# EAGLE design gamebuino-hack (EAGLE 9.5.2)
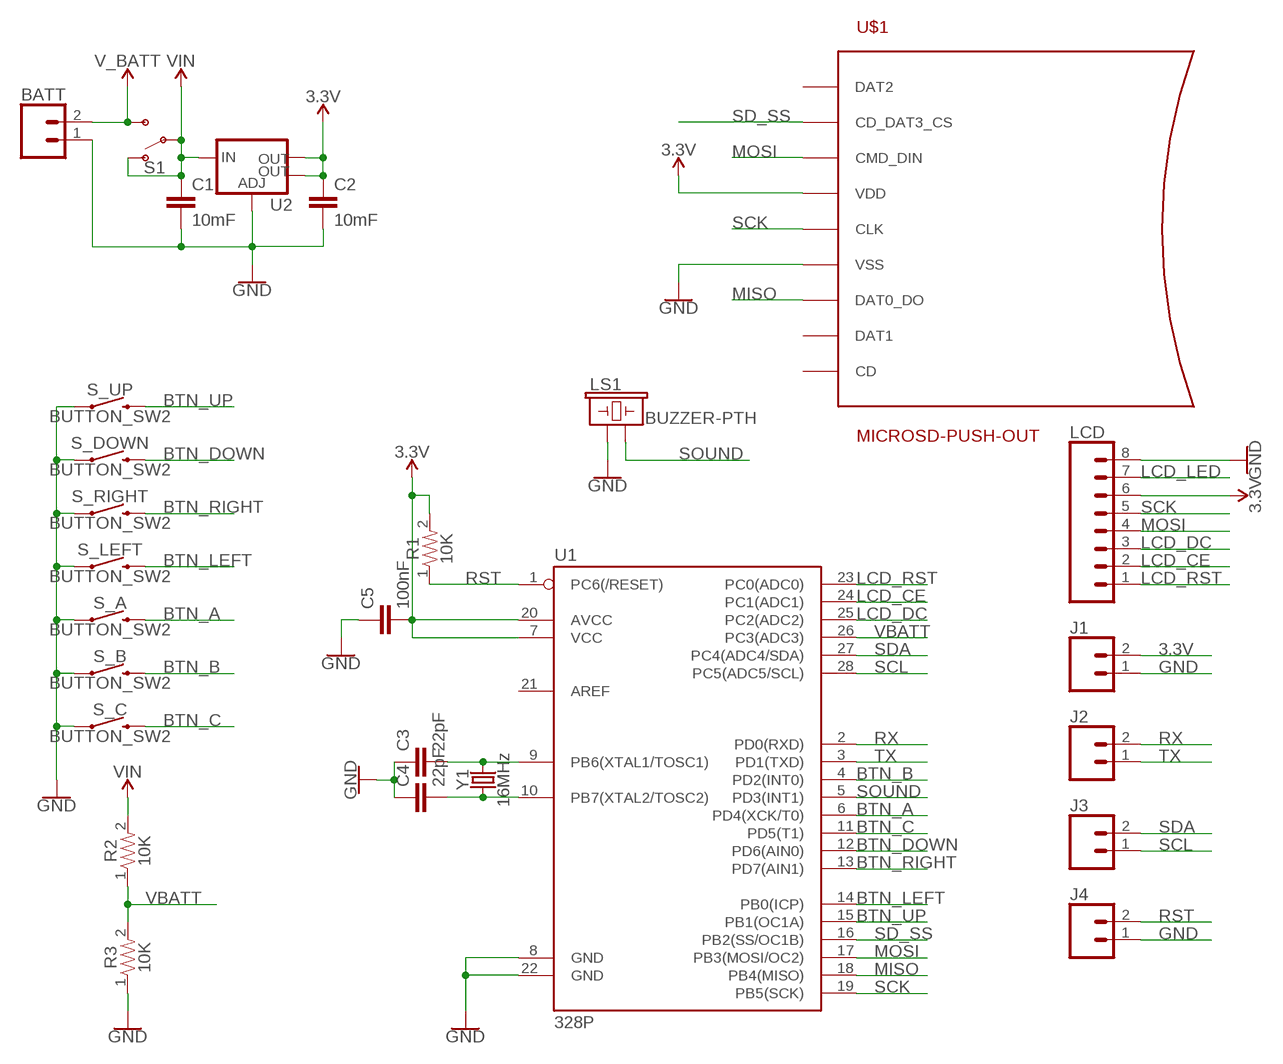
[diagram p0: schematic, sheet 1]

## Parts
BATT  CONN_02  [1X02]
C1  10mF  CAP-805  [0805]
C2  10mF  CAP-805  [0805]
C3  22pF  CAP-805  [0805]
C4  22pF  CAP-805  [0805]
C5  100nF  CAP-805  [0805]
J1  CONN_02  [1X02]
J2  CONN_02  [1X02]
J3  CONN_02  [1X02]
J4  CONN_02  [1X02]
LCD  CONN_08"  [1X08]
LS1  BUZZER-PTH  [BUZZER-12MM]
R1  10K  RESISTOR-805  [0805]
R2  10K  RESISTOR-805  [0805]
R3  10K  RESISTOR-805  [0805]
S1  SWITCH-SPDT-PTH-11.6X4.0MM  [SWITCH_SPDT_PTH_11.6X4.0MM]
S_A  BUTTON_SW2  [BUTTON_SW2]
S_B  BUTTON_SW2  [BUTTON_SW2]
S_C  BUTTON_SW2  [BUTTON_SW2]
S_DOWN  BUTTON_SW2  [BUTTON_SW2]
S_LEFT  BUTTON_SW2  [BUTTON_SW2]
S_RIGHT  BUTTON_SW2  [BUTTON_SW2]
S_UP  BUTTON_SW2  [BUTTON_SW2]
U1  328P  ATMEGA328P_PDIP  [DIP28]
U2  V_REG_LM1117SOT223  [SOT223]
U$1  MICROSD-PUSH-OUT  [MICROSD-PUSH-OUT]
Y1  16MHz  CRYSTAL-16MHZPTH-HC49US  [HC49US]

## Nets
3.3V: C2.1 C5.2 J1.2 LCD.6 R1.2 U1.7(VCC) U1.20(AVCC) U2.2(OUT) U2.4(OUT) U$1.4(VDD)
BTN_A: S_A.2 U1.6(PD4(XCK/T0))
BTN_B: S_B.2 U1.4(PD2(INT0))
BTN_C: S_C.2 U1.11(PD5(T1))
BTN_DOWN: S_DOWN.2 U1.12(PD6(AIN0))
BTN_LEFT: S_LEFT.2 U1.14(PB0(ICP))
BTN_RIGHT: S_RIGHT.2 U1.13(PD7(AIN1))
BTN_UP: S_UP.2 U1.15(PB1(OC1A))
GND: BATT.1 C1.2 C2.2 C3.1 C4.1 C5.1 J1.1 J4.1 LCD.8 LS1.+ R3.1 S_A.1 S_B.1 S_C.1 S_DOWN.1 S_LEFT.1 S_RIGHT.1 S_UP.1 U1.8(GND) U1.22(GND) U2.1(ADJ) U$1.6(VSS) U$1.G1(VSS) U$1.G2(VSS) U$1.G3(VSS) U$1.G4(VSS)
LCD_CE: LCD.2 U1.24(PC1(ADC1))
LCD_DC: LCD.3 U1.25(PC2(ADC2))
LCD_LED: LCD.7
LCD_RST: LCD.1 U1.23(PC0(ADC0))
MISO: U1.18(PB4(MISO)) U$1.7(DAT0_DO)
MOSI: LCD.4 U1.17(PB3(MOSI/OC2)) U$1.3(CMD_DIN)
N$9: C3.2 U1.9(PB6(XTAL1/TOSC1)) Y1.2
N$10: C4.2 U1.10(PB7(XTAL2/TOSC2)) Y1.1
RST: J4.2 R1.1 U1.1(PC6(/RESET))
RX: J2.2 U1.2(PD0(RXD))
SCK: LCD.5 U1.19(PB5(SCK)) U$1.5(CLK)
SCL: J3.1 U1.28(PC5(ADC5/SCL))
SD_SS: U1.16(PB2(SS/OC1B)) U$1.2(CD_DAT3_CS)
SDA: J3.2 U1.27(PC4(ADC4/SDA))
SOUND: LS1.- U1.5(PD3(INT1))
TX: J2.1 U1.3(PD1(TXD))
V_BATT: BATT.2 S1.3(S)
VBATT: R2.1 R3.2 U1.26(PC3(ADC3))
VIN: C1.1 R2.2 S1.1(O) S1.2(P) U2.3(IN)
Unconnected: U1.21(AREF) U$1.1(DAT2) U$1.8(DAT1) U$1.CD

## Library data of the parts
BATT J1-J4 = SparkFun-Connectors:CONN_02: Multi connection point. Often used as Generic Header-pin footprint for 0.1 inch spaced/style header connections On any of the 0.1 inch spaced packages, you can populate with these: Break Away Headers - Straight <https://www.sparkfun.com/products/116> (PRT-00116) Break Away Male Headers - Right Angle <https://www.sparkfun.com/products/553> (PRT-00553) Female Headers <https://www.sparkfun.com/products/115> (PRT-00115) Break Away Headers - Machine Pin <https://www.sparkfun.com/products/117> (PRT-00117) Break Away Female Headers - Swiss Machine Pin <https://www.sparkfun.com/products/743> (PRT-00743) For SCREWTERMINALS and SPRING TERMINALS visit here: Screw Terimnals on SparkFun.com <https://www.sparkfun.com/search/results?term=Screw+Terminals> (5mm/3.5mm/2.54mm spacing) This device is also useful as a general connection point to wire up your design to another part of your project. Our various solder wires solder well into these plated through hole pads. Hook-Up Wire - Assortment (Stranded, 22 AWG) <https://www.sparkfun.com/products/11375> (PRT-11375) Hook-Up Wire - Assortment (Solid Core, 22 AWG) <https://www.sparkfun.com/products/11367> (PRT-11367) View the entire wire category on our website here <https://www.sparkfun.com/categories/141> Special notes: Molex polarized connector foot print use with: PRT-08233 with associated crimp pins and housings. 2.54_SCREWTERM for use with PRT-10571. 3.5mm Screw Terminal footprints for PRT-08084 5mm Screw Terminal footprints for use with PRT-08432
C1-C5 = myParts:CAP: Generic capacitor
LCD = SparkFun-Connectors:CONN_08: Multi connection point. Often used as Generic Header-pin footprint for 0.1 inch spaced/style header connections On any of the 0.1 inch spaced packages, you can populate with these: Break Away Headers - Straight <https://www.sparkfun.com/products/116> (PRT-00116) Break Away Male Headers - Right Angle <https://www.sparkfun.com/products/553> (PRT-00553) Female Headers <https://www.sparkfun.com/products/115> (PRT-00115) Break Away Headers - Machine Pin <https://www.sparkfun.com/products/117> (PRT-00117) Break Away Female Headers - Swiss Machine Pin <https://www.sparkfun.com/products/743> (PRT-00743) Arduino Stackable Header - 8 Pin <https://www.sparkfun.com/products/9279> (PRT-09279) For SCREWTERMINALS and SPRING TERMINALS visit here: Screw Terimnals on SparkFun.com <https://www.sparkfun.com/search/results?term=Screw+Terminals> (5mm/3.5mm/2.54mm spacing) This device is also useful as a general connection point to wire up your design to another part of your project. Our various solder wires solder well into these plated through hole pads. Hook-Up Wire - Assortment (Stranded, 22 AWG) <https://www.sparkfun.com/products/11375> (PRT-11375) Hook-Up Wire - Assortment (Solid Core, 22 AWG) <https://www.sparkfun.com/products/11367> (PRT-11367) View the entire wire category on our website here <https://www.sparkfun.com/categories/141> Special notes: Molex polarized connector foot print use with SKU : PRT-08231 with associated crimp pins and housings. 1MM SMD Version SKU: PRT-10208 NOTES ON THE VARIANTS LOCK and LOCK_LONGPADS... This footprint was designed to help hold the alignment of a through-hole component (i.e. 6-pin header) while soldering it into place. You may notice that each hole has been shifted either up or down by 0.005 of an inch from it's more standard position (which is a perfectly straight line). This slight alteration caused the pins (the squares in the middle) to touch the edges of the holes. Because they are alternating, it causes a "brace" to hold the component in place. 0.005 has proven to be the perfect amount of "off-center" position when using our standard breakaway headers. Although looks a little odd when you look at the bare footprint, once you have a header in there, the alteration is very hard to notice. Also,if you push a header all the way into place, it is covered up entirely on the bottom side.; PROD_ID: CONN-08438
LS1 = SparkFun-Electromechanical:BUZZER: Buzzer Small round buzzers that operate around the audible 2kHz range. You can use these as speakers to create simple music or user interfaces. Variant Overview: PTH - Mini Speaker - PC Mount 12mm 2.048kHz <https://www.sparkfun.com/products/7950> PTH_KIT - Mini Speaker - PC Mount 12mm 2.048kHz <https://www.sparkfun.com/products/7950> KIT simplifies soldering by adding stop mask to one side of the pads. PTH_NO_SILK - Mini Speaker - PC Mount 12mm 2.048kHz <https://www.sparkfun.com/products/7950> No silkscreen indicator of buzzer outline. PTH_KIT_NO_SILK - Mini Speaker - PC Mount 12mm 2.048kHz <https://www.sparkfun.com/products/7950> KIT package w/o silkscreen SMD - Buzzer Audio Magnetic (CCV-084B16) SMD buzzer used on, e.g. the LilyPad Buzzer <https://www.sparkfun.com/products/8463> and RFID USB Reader <https://www.sparkfun.com/products/9963>. SMD_KIT - Buzzer Audio Magnetic (CCV-084B16) SMD Buzzer with elongated pins to make soldering easier. Used on the SparkFun Simon Says - Surface Mount Soldering Kit <https://www.sparkfun.com/products/10935>.; PROD_ID: COMP-08253; SF_SKU: COM-07950
R1-R3 = myParts:RESISTOR: Generic resistor
S1 = SparkFun-Switches:SWITCH-SPDT: Single Pole, Double Throw (SPDT) Switch Single-pole, double-throw (SPDT) switch. Variant Overview SMD-AYZ0202 Surface Mount DPDT Switch <https://www.sparkfun.com/products/597> (COM-00597) Used on e.g. LilyPad Arduino USB - ATmega32U4 Board <https://www.sparkfun.com/products/12049> PTH-11.6X4.0MM SPDT Mini Power Switch <https://www.sparkfun.com/products/102> (COM-00102) Used on e.g. SparkFun Simon Says - Through-Hole Soldering Kit <https://www.sparkfun.com/products/10547> (KIT-10547) PTH-11.6X4.0MM-KIT KIT version of SPDT Mini Power Switch - Simplifies soldering by removing tStop of switch pins - only one side can be soldered. PTH-11.6X4.0MM-LOCK LOCK version of SPDT Mini Power Switch - Offset pins hold switch in place for easier soldering. SMD-RIGHT-ANGLE Surface Mount Right Angle Switch <https://www.sparkfun.com/products/10860> (COM-10860) Used on e.g. SparkFun ESP8266 Thing <https://www.sparkfun.com/products/13231>; PROD_ID: SWCH-08261; SF_SKU: COM-00102
S_A S_B S_C S_DOWN S_LEFT S_RIGHT S_UP = myParts:BUTTON_SW2: 2 connector push button
U1 = SparkFun-IC-Microcontroller:ATMEGA328P_PDIP: Atmel 328P Through hole ATMEGA328P uC used in the Arduino 32kb flash, 1k EEPROM, 2k SRAM Datasheet <http://www.sparkfun.com/datasheets/Components/SMD/ATMega328.pdf> SparkFun Products Storefront component: AVR 28 Pin 20MHz 32K 6A/D - ATMega328P <https://www.sparkfun.com/products/9061> (COM-09061) SparkFun Simon Says - Through-Hole Soldering Kit <https://www.sparkfun.com/products/10547> (KIT-10547) SparkFun Learn to Solder - Simon Says <https://www.sparkfun.com/products/13708> (KIT-13708) SparkFun BigTime Watch Kit <https://www.sparkfun.com/products/11734> (KIT-11734) SparkFun ClockIt <https://www.sparkfun.com/products/10930> (KIT-10930) SparkFun Serial Enabled LCD Kit <https://www.sparkfun.com/products/10097> (LCD-10097) SparkFun Simon Tilts - Through Hole Soldering Kit <https://www.sparkfun.com/products/12634> (KIT-12634) SparkFun Frequency Counter Kit <https://www.sparkfun.com/products/10140> (KIT-10140) FabFM Radio Kit <https://www.sparkfun.com/products/11043> (KIT-11043) SparkFun Binary Blaster Kit <https://www.sparkfun.com/products/12037> (KIT-12037) SparkFun Metro-Gnome <https://www.sparkfun.com/products/9236> (KIT-09236) ATmega328 with Arduino Optiboot (Uno) <https://www.sparkfun.com/products/10524> (DEV-10524); PROD_ID: IC-09136
U2 = SparkFun-IC-Power:V_REG_LM1117: Voltage Regulator LM1117 Standard adjustable voltage regulator but in SMD form. Spark Fun Electronics SKU : COM-00595; PROD_ID: VREG-08170
U$1 = microsd:MICROSD-PUSH-OUT: T-Flash Push-Out Micro SD Card Reader 14.75mm x 14.5mm SMD with external pins
Y1 = SparkFun-Clocks:CRYSTAL-16MHZ: 16MHz Crystal Digikey Example <http://www.digikey.com/product-search/en?keywords=535-9122-1-ND> Frequency: 16MHz Frequency Stability: ±50ppm Frequency Tolerance: ±20ppm Load Capacitance: 18pF SparkFun Products: Pro Micro -5V/16MHz <https://www.sparkfun.com/products/12640> SparkFun Serial Enabled LCD Kit <https://www.sparkfun.com/products/10097>; PROD_ID: XTAL-08181; SF_ID: COM-00536

## Board
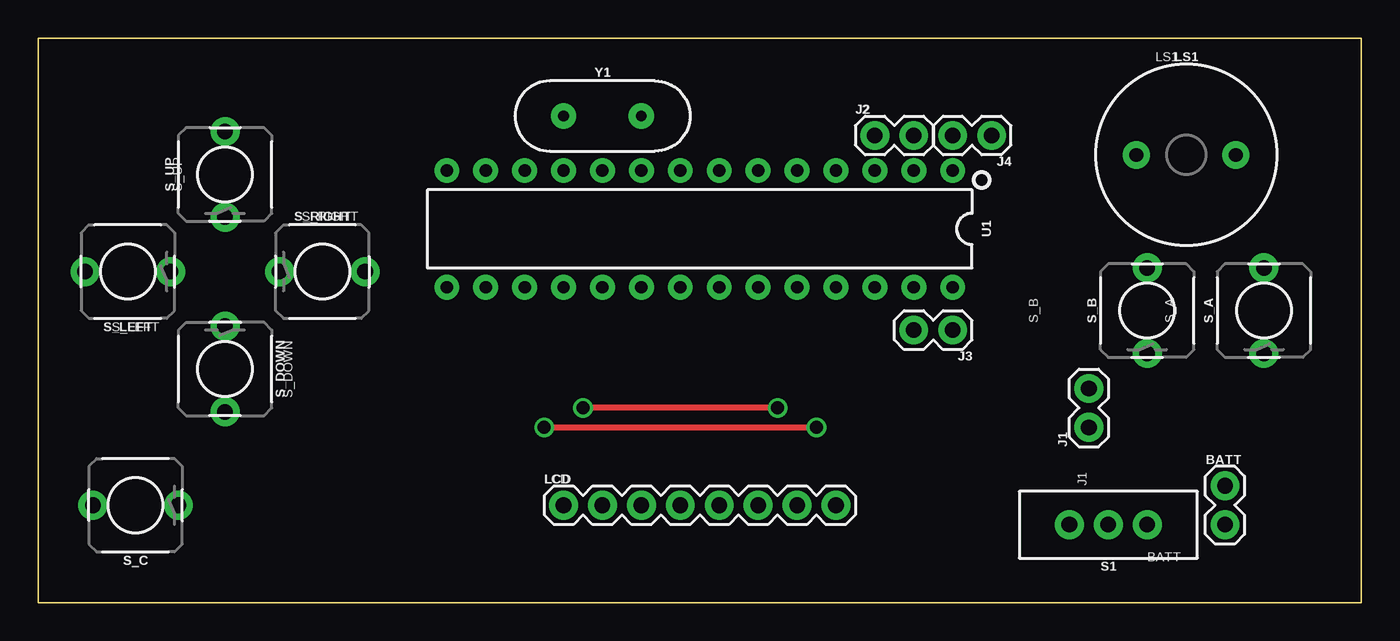
[diagram p1: board, top side]
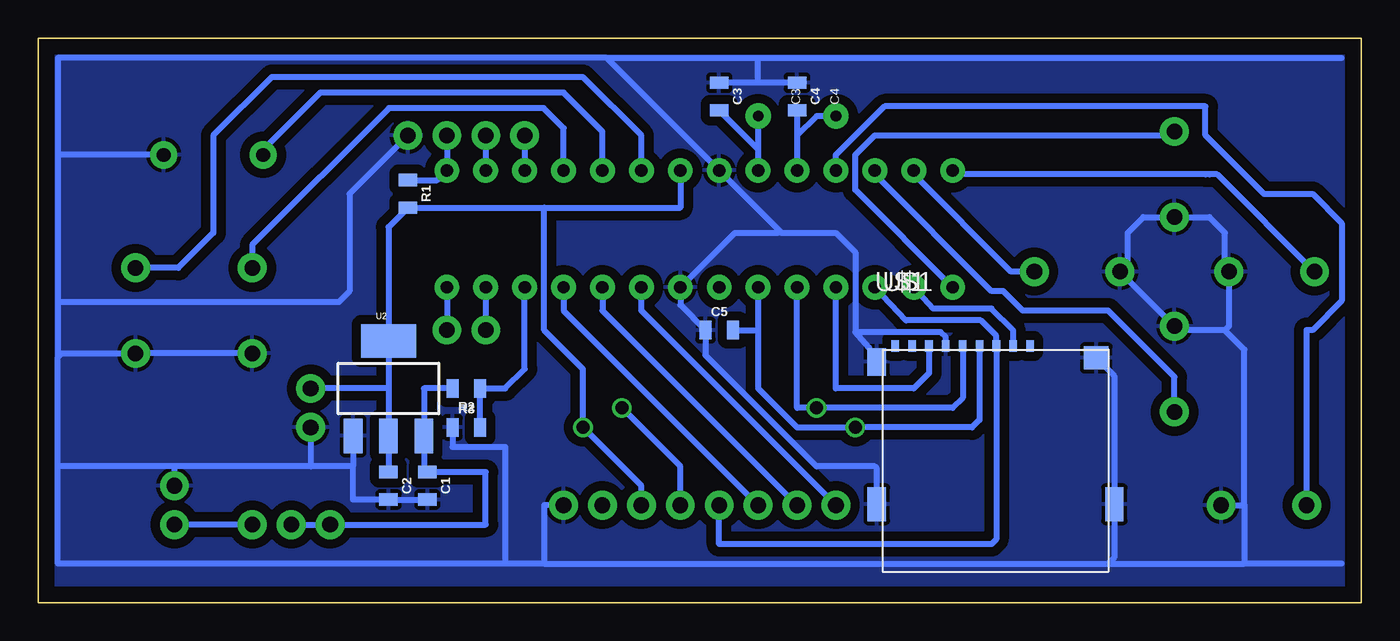
[diagram p2: board, bottom side, seen from below]

Size 86.36 x 36.82 mm. Coordinates in mm from the lower left corner, seen from the top.
Outline: 0,0 86.36,0 86.36,36.82 0,36.82 0,0
Copper layers (1*16): Top 0.035mm / dielectric 1.5mm / Bottom 0.035mm
Design rules "default": minimum track width 6mil, minimum drill 0.35mm, track to track 6mil, track to pad 6mil, pad to pad 6mil, via to via 6mil, smd to smd 6mil, copper to edge 40mil, drill to drill 6mil, minimum pad ring 10mil, minimum via ring 8mil, stop-mask expansion 4mil, vias tented up to drill 0mil, thermal gap 10mil

### Footprints (pad centres in the part's own frame; a part is rotated, then mirrored left to right if it is on the bottom)
1X02 = drill 1.016 pad 1.88: 1 0,0; 2 2.54,0
0805 = smd 0.8 x 1.2: 1 -0.9,0; 2 0.9,0
1X08 = drill 1.016 pad 1.88: 1 0,0; 2 2.54,0; 3 5.08,0; 4 7.62,0; 5 10.16,0; 6 12.7,0; 7 15.24,0; 8 17.78,0
BUZZER-12MM = drill 0.9 pad 1.778: + 3.25,0; - -3.25,0
SWITCH_SPDT_PTH_11.6X4.0MM = drill 1.016 pad 1.88: 1 0,2.54; 2 0,0; 3 0,-2.54
BUTTON_SW2 = drill 1.016 pad 1.88: 1 -2.794,0; 2 2.794,0
DIP28 = drill 0.813 pad 1.626: 1 -16.51,-3.81; 2 -13.97,-3.81; 3 -11.43,-3.81; 4 -8.89,-3.81; 5 -6.35,-3.81; 6 -3.81,-3.81; 7 -1.27,-3.81; 8 1.27,-3.81; 9 3.81,-3.81; 10 6.35,-3.81; 11 8.89,-3.81; 12 11.43,-3.81; 13 13.97,-3.81; 14 16.51,-3.81; 15 16.51,3.81; 16 13.97,3.81; 17 11.43,3.81; 18 8.89,3.81; 19 6.35,3.81; 20 3.81,3.81; 21 1.27,3.81; 22 -1.27,3.81; 23 -3.81,3.81; 24 -6.35,3.81; 25 -8.89,3.81; 26 -11.43,3.81; 27 -13.97,3.81; 28 -16.51,3.81
SOT223 = smd 1.219 x 2.235: 1 -2.311,-3.099; 2 0,-3.099; 3 2.311,-3.099 | smd 3.6 x 2.2: 4 0,3.099
MICROSD-PUSH-OUT = smd 0.5 x 0.75: 1 9.625,0.225; 2 8.525,0.225; 3 7.425,0.225; 4 6.325,0.225; 5 5.225,0.225; 6 4.125,0.225; 7 3.025,0.225; 8 1.925,0.225; CD 0.825,0.225 | smd 1.2 x 1.8: G1 -0.375,-0.8 | smd 1.2 x 2.2: G2 -0.375,-10.1; G4 15.125,-10.1 | smd 1.6 x 1.5: G3 13.95,-0.55
HC49US = drill 0.7 pad 1.651: 1 -2.54,0; 2 2.54,0

### Placement (x,y rotation side)
BATT  77.47,7.62 270 top
C1  60.96,7.62 270 bottom
C2  63.5,7.62 270 bottom
C3  41.91,33.02 270 bottom
C4  36.83,33.02 270 bottom
C5  41.91,17.78 0 bottom
J1  68.58,11.43 90 top
J2  54.61,30.48 0 top
J3  59.69,17.78 180 top
J4  62.23,30.48 180 top
LCD  34.29,6.35 0 top
LS1  74.93,29.21 0 top
R1  62.23,26.67 270 bottom
R2  58.42,13.97 180 bottom
R3  58.42,11.43 0 bottom
S1  69.85,5.08 90 top
S_A  80.01,19.05 90 top
S_B  72.39,19.05 90 top
S_C  6.35,6.35 180 top
S_DOWN  12.19,15.24 270 top
S_LEFT  5.84,21.59 180 top
S_RIGHT  18.54,21.59 0 top
S_UP  12.19,27.94 90 top
U1  43.18,24.38 180 top
U2  63.5,13.97 0 bottom
U$1  31.24,16.51 0 bottom
Y1  36.83,31.75 0 top

### Tracks (layer width: path | path; a pad name or v marks a point on that pad's centre or on a via)
3.3V  (via drill 0.85)
  Top 0.406: v33.02,11.43 v50.8,11.43
  Bottom 0.406: U1.20 39.37,17.78 | 39.37,17.78 39.37,13.97 36.83,11.43 v33.02,11.43 25.4,11.43 24.92,11.91 U$1.4 | C5.2 39.37,17.78 | 44.45,27.94 U1.7 44.45,25.77 53.34,25.77 | 53.34,25.77 R1.2 63.5,24.5 U2.4 63.5,13.97 | LCD.6 46.99,7.62 v50.8,11.43 50.8,15.24 53.34,17.78 53.34,25.77 | 63.5,13.97 U2.2 C2.1 | 63.5,13.97 J1.2
BTN_A
  Bottom 0.406: U1.6 46.99,30.48 50.8,34.29 71.12,34.29 74.93,30.48 74.93,24.13 77.22,21.84 S_A.2
BTN_B
  Bottom 0.406: U1.4 52.07,30.96 53.37,32.26 63.48,32.26 72.39,23.34 S_B.2
BTN_C
  Bottom 0.406: S_C.2 3.56,17.78 3.17,17.78 1.27,19.68 1.27,24.77 3.17,26.67 6.35,26.67 10.16,30.48 10.16,32.38 31.11,32.38 34.29,29.21 U1.11
BTN_DOWN
  Bottom 0.406: U1.12 31.75,27.94 24.13,20.32 23.37,20.32 22.1,19.05 16.51,19.05 12.19,14.73 S_DOWN.2
BTN_LEFT
  Bottom 0.406: U1.14 26.42,27.94 10.16,27.94 9.91,27.94 9.4,27.94 S_LEFT.2
BTN_RIGHT
  Bottom 0.406: S_RIGHT.2 22.86,21.59 29.21,27.94 U1.13
BTN_UP
  Bottom 0.406: S_UP.2 12.95,30.48 31.75,30.48 33.02,29.21 33.02,26.92 U1.15
GND
  Bottom 0.406: U$1.G1 32.12,16.63 33.02,17.65 | 33.02,17.65 33.02,22.86 34.29,24.13 37.85,24.13 37.97,24.26 | 7.62,6.35 7.62,16.51 8.89,17.78 | S_C.1 7.62,6.35 | U$1.G4 16.51,6.29 | 1.27,2.54 7.62,2.54 | 7.62,6.35 7.62,2.54 | 85.09,29.21 85.09,19.61 | LS1.+ 85.09,29.21 | 53.34,2.54 53.34,6.35 LCD.8 | 53.34,2.54 16.51,2.54 | 16.51,2.54 7.62,2.54 | 37.97,24.26 U1.8 49.27,35.55 | J4.1 66.04,26.67 66.04,20.32 66.75,19.61 85.09,19.61 | S_B.1 S_A.1 84.84,16.26 85.09,16 | U2.1 65.81,8.89 | 53.34,2.54 55.88,2.54 | 55.88,2.54 85.09,2.54 85.09,8.89 | 85.09,8.89 85.09,16 | 37.97,24.26 38.1,24.13 40.89,24.13 U1.22 44.45,19.42 C5.1 42.81,16.14 35.56,8.89 31.75,8.89 31.62,8.76 U$1.G2 | C1.2 C2.2 65.81,6.72 65.81,8.89 | 65.81,8.89 68.58,8.89 | 68.58,8.89 77.47,8.89 | 77.47,8.89 85.09,8.89 | BATT.1 77.47,8.89 | J1.1 68.58,8.89 | R3.1 59.32,10.16 55.88,10.16 55.88,2.54 | 49.27,35.55 85.09,35.55 85.09,29.21 | C4.1 39.37,33.92 | 39.37,33.92 C3.1 | 49.27,35.55 39.37,35.55 | 39.37,35.55 1.27,35.55 | 39.37,33.92 39.37,35.55 | 85.09,19.61 85.09,16 | 8.89,17.78 11.94,17.78 S_DOWN.1 S_RIGHT.1 15.24,22.1 15.24,24.13 14.22,25.15 S_UP.1 9.91,25.15 8.89,24.13 8.89,21.84 S_LEFT.1 8.64,18.03 8.89,17.78 | U$1.6 27.12,17.33 27.44,17.65 33.02,17.65 | U$1.G3 16.12,14.79 U$1.G4 | U$1.G4 16.12,2.93 16.51,2.54
  pour Bottom (isolate 0.61): 0,36.83 86.36,36.83 86.36,0 0,0
LCD_CE
  Bottom 0.406: U1.24 49.53,19.05 LCD.2
LCD_DC
  Bottom 0.406: LCD.3 52.07,19.05 U1.25
LCD_RST
  Bottom 0.406: LCD.1 46.99,19.05 U1.23
MISO
  Bottom 0.406: U1.18 34.29,13.97 29.21,13.97 28.22,14.96 U$1.7
MOSI
  Bottom 0.406: U1.17 29.72,18.41 24.83,18.41 23.82,17.4 U$1.3 23.82,4.12 24.13,3.81 41.91,3.81 LCD.4
N$9
  Bottom 0.406: Y1.2 39.37,29.58 | U1.9 39.37,29.21 39.37,29.58 | C3.2 39.37,29.58
N$10
  Bottom 0.406: 36.83,30.48 U1.10 | Y1.1 35.56,31.75 36.83,30.48 | C4.2 36.83,30.48
RST
  Bottom 0.406: J4.2 U1.1 60.31,27.57 R1.1
RX
  Bottom 0.406: J2.2 U1.2
SCK  (via drill 0.85)
  Top 0.406: v48.26,12.7 v35.56,12.7
  Bottom 0.406: U1.19 36.83,12.7 v35.56,12.7 26.67,12.7 26.02,13.35 U$1.5 | LCD.5 44.45,8.89 v48.26,12.7
SCL
  Bottom 0.406: U1.28 J3.1
SD_SS
  Bottom 0.406: U1.16 27.94,19.18 24.13,19.18 22.72,17.76 U$1.2
SDA
  Bottom 0.406: U1.27 J3.2
SOUND
  Bottom 0.406: U1.5 49.53,30.73 52.07,33.27 67.96,33.27 71.68,29.55 LS1.-
TX
  Bottom 0.406: J2.1 U1.3
V_BATT
  Bottom 0.406: S1.3 BATT.2
VBATT
  Bottom 0.406: R3.2 R2.1 55.88,13.97 54.61,15.24 U1.26
VIN
  Bottom 0.406: S1.2 S1.1 57.15,5.08 57.15,8.52 C1.1 61.19,8.52 U2.3 61.19,13.97 R2.2

### Text on the board
_tNames: LS1 | Y1 | J2 | J4 | S_UP | S_RIGHT | U1 | S_B | S_A | S_LEFT | J3 | S_DOWN | LCD | J1 | S_C | BATT
_bNames: C4 | C3 | R1 | U$1 | C5 | U2 | R2 | R3 | C1 | C2